# EAGLE schematic dshield (EAGLE 7.7.0)
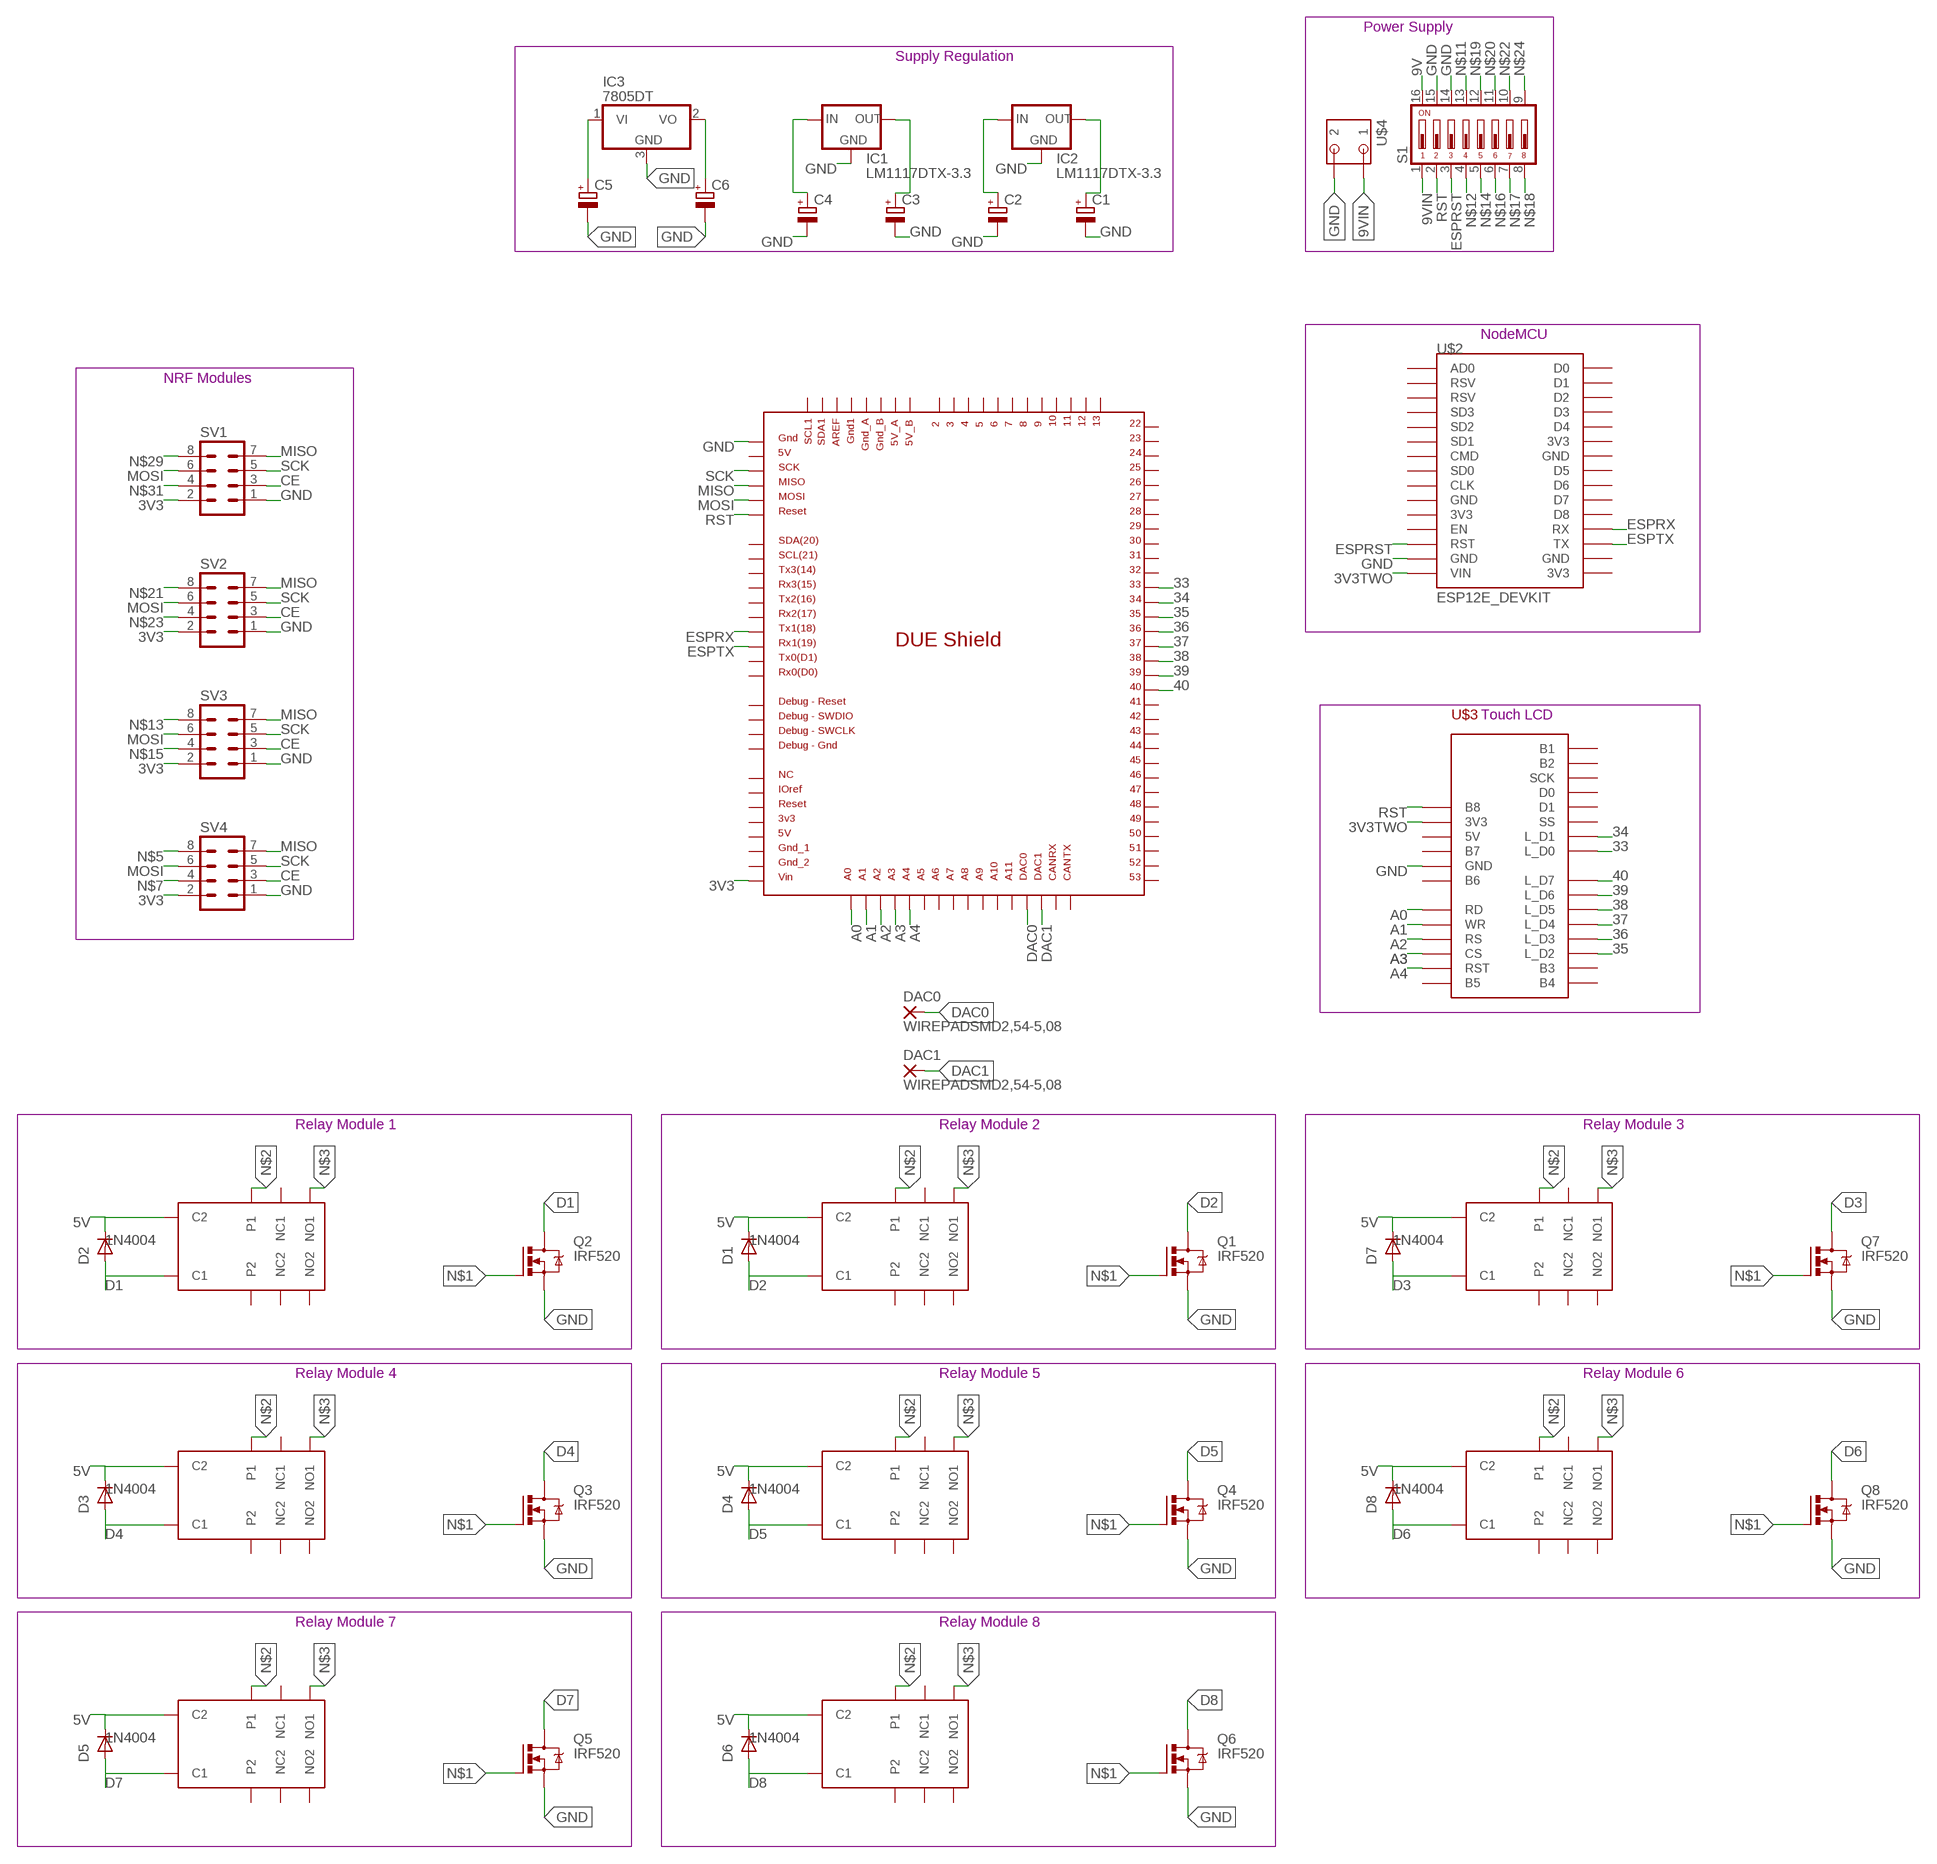
[diagram p0: schematic, sheet 1]

## Parts
BTPL1  GS-SH-2XXT  [G_RELAY_SMD]
BTPL2  GS-SH-2XXT  [G_RELAY_SMD]
BTPL3  GS-SH-2XXT  [G_RELAY_SMD]
BTPL4  GS-SH-2XXT  [G_RELAY_SMD]
BTPL5  GS-SH-2XXT  [G_RELAY_SMD]
BTPL6  GS-SH-2XXT  [G_RELAY_SMD]
BTPL7  GS-SH-2XXT  [G_RELAY_SMD]
BTPL8  GS-SH-2XXT  [G_RELAY_SMD]
C1  CPOL-EUE2.5-6  [E2,5-6]
C2  CPOL-EUE2.5-6  [E2,5-6]
C3  CPOL-EUE2.5-6  [E2,5-6]
C4  CPOL-EUE2.5-6  [E2,5-6]
C5  CPOL-EUE2.5-6  [E2,5-6]
C6  CPOL-EUE2.5-6  [E2,5-6]
D1  1N4004  [DO41-10]
D2  1N4004  [DO41-10]
D3  1N4004  [DO41-10]
D4  1N4004  [DO41-10]
D5  1N4004  [DO41-10]
D6  1N4004  [DO41-10]
D7  1N4004  [DO41-10]
D8  1N4004  [DO41-10]
DAC0  WIREPADSMD2,54-5,08  [SMD2,54-5,08]
DAC1  WIREPADSMD2,54-5,08  [SMD2,54-5,08]
IC1  LM1117DTX-3.3  [TO252]
IC2  LM1117DTX-3.3  [TO252]
IC3  7805DT  [TO252]
Q1  IRF520  [TO220BV]
Q2  IRF520  [TO220BV]
Q3  IRF520  [TO220BV]
Q4  IRF520  [TO220BV]
Q5  IRF520  [TO220BV]
Q6  IRF520  [TO220BV]
Q7  IRF520  [TO220BV]
Q8  IRF520  [TO220BV]
S1  DS08  [DS-08]
SV1  MA04-2  [MA04-2]
SV2  MA04-2  [MA04-2]
SV3  MA04-2  [MA04-2]
SV4  MA04-2  [MA04-2]
U$1  DUE(NORMAL)  [DUE(NORMAL)]
U$2  ESP12E_DEVKIT  [ESP12E_DEVKIT]
U$3  SPFD5408  [SPFD5408]
U$4  SPTBB2-A2  [SPTB]

## Nets
3V3: C3.+ IC1.TAB(OUT) SV1.2 SV2.2 SV3.2 SV4.2 U$1.VIN
3V3TWO: C1.+ IC2.TAB(OUT) U$2.VIN U$3.3V3
5V: BTPL1.C2 BTPL2.C2 BTPL3.C2 BTPL4.C2 BTPL5.C2 BTPL6.C2 BTPL7.C2 BTPL8.C2 C6.+ D1.C D2.C D3.C D4.C D5.C D6.C D7.C D8.C IC3.2(VO)
9V: C2.+ C4.+ C5.+ IC1.2(IN) IC2.2(IN) IC3.1(VI) S1.16
9VIN: S1.1 U$4.B2
33: U$1.33 U$3.L_D0
34: U$1.34 U$3.L_D1
35: U$1.35 U$3.L_D2
36: U$1.36 U$3.L_D3
37: U$1.37 U$3.L_D4
38: U$1.38 U$3.L_D5
39: U$1.39 U$3.L_D6
40: U$1.40 U$3.L_D7
A0: U$1.A0 U$3.RD
A1: U$1.A1 U$3.WR
A2: U$1.A2 U$3.RS
A3: U$1.A3 U$3.CS
A4: U$1.A4 U$3.RST
CE: SV1.3 SV2.3 SV3.3 SV4.3
D1: BTPL2.C1 D2.A Q2.D
D2: BTPL1.C1 D1.A Q1.D
D3: BTPL7.C1 D7.A Q7.D
D4: BTPL3.C1 D3.A Q3.D
D5: BTPL4.C1 D4.A Q4.D
D6: BTPL8.C1 D8.A Q8.D
D7: BTPL5.C1 D5.A Q5.D
D8: BTPL6.C1 D6.A Q6.D
DAC0: DAC0.1(P) U$1.DAC0
DAC1: DAC1.1(P) U$1.DAC1
ESPRST: S1.3 U$2.RST
ESPRX: U$1.TX1 U$2.RX
ESPTX: U$1.RX1 U$2.TX
GND: C1.- C2.- C3.- C4.- C5.- C6.- IC1.1(GND) IC2.1(GND) IC3.3(GND) Q1.S Q2.S Q3.S Q4.S Q5.S Q6.S Q7.S Q8.S S1.14 S1.15 SV1.1 SV2.1 SV3.1 SV4.1 U$1.5V_ICSP U$2.GND@1(GND) U$3.GND U$4.A2
MISO: SV1.7 SV2.7 SV3.7 SV4.7 U$1.MISO_ICSP
MOSI: SV1.6 SV2.6 SV3.6 SV4.6 U$1.MOSI_ICSP
N$1: Q1.G Q2.G Q3.G Q4.G Q5.G Q6.G Q7.G Q8.G
N$2: BTPL1.P1 BTPL2.P1 BTPL3.P1 BTPL4.P1 BTPL5.P1 BTPL6.P1 BTPL7.P1 BTPL8.P1
N$3: BTPL1.NO1 BTPL2.NO1 BTPL3.NO1 BTPL4.NO1 BTPL5.NO1 BTPL6.NO1 BTPL7.NO1 BTPL8.NO1
N$5: SV4.8
N$7: SV4.4
N$11: S1.13
N$12: S1.4
N$13: SV3.8
N$14: S1.5
N$15: SV3.4
N$16: S1.6
N$17: S1.7
N$18: S1.8
N$19: S1.12
N$20: S1.11
N$21: SV2.8
N$22: S1.10
N$23: SV2.4
N$24: S1.9
N$29: SV1.8
N$31: SV1.4
RST: S1.2 U$1.RESET_ICSP U$3.B8
SCK: SV1.5 SV2.5 SV3.5 SV4.5 U$1.SCK_ICSP
Unconnected: BTPL1.NC1 BTPL1.NC2 BTPL1.NO2 BTPL1.P2 BTPL2.NC1 BTPL2.NC2 BTPL2.NO2 BTPL2.P2 BTPL3.NC1 BTPL3.NC2 BTPL3.NO2 BTPL3.P2 BTPL4.NC1 BTPL4.NC2 BTPL4.NO2 BTPL4.P2 BTPL5.NC1 BTPL5.NC2 BTPL5.NO2 BTPL5.P2 BTPL6.NC1 BTPL6.NC2 BTPL6.NO2 BTPL6.P2 BTPL7.NC1 BTPL7.NC2 BTPL7.NO2 BTPL7.P2 BTPL8.NC1 BTPL8.NC2 BTPL8.NO2 BTPL8.P2 U$1.2 U$1.3 U$1.3V3 U$1.4 U$1.5 U$1.5V U$1.5V_A U$1.5V_B U$1.6 U$1.7 U$1.8 U$1.9 U$1.10 U$1.11 U$1.12 U$1.13 U$1.22 U$1.23 U$1.24 U$1.25 U$1.26 U$1.27 U$1.28 U$1.29 U$1.30 U$1.31 U$1.32 U$1.41 U$1.42 U$1.43 U$1.44 U$1.45 U$1.46 U$1.47 U$1.48 U$1.49 U$1.50 U$1.51 U$1.52 U$1.53 U$1.A5 U$1.A6 U$1.A7 U$1.A8 U$1.A9 U$1.A10 U$1.A11 U$1.AREF U$1.CANRX U$1.CANTX U$1.GND1 U$1.GND_1 U$1.GND_2 U$1.GND_A U$1.GND_B U$1.GND_DEBUG U$1.GND_ICSP U$1.IOREF U$1.NC U$1.RESET U$1.RESET_DEBUG U$1.RX0 U$1.RX2 U$1.RX3 U$1.SCL U$1.SCL1 U$1.SDA U$1.SDA1 U$1.SWCLK_DEBUG U$1.SWDIO_DEBUG U$1.TX0 U$1.TX2 U$1.TX3 U$2.3V3@0(3V3) U$2.3V3@1(3V3) U$2.3V3@2(3V3) U$2.AD0 U$2.CLK U$2.CMD U$2.D0 U$2.D1 U$2.D2 U$2.D3 U$2.D4 U$2.D5 U$2.D6 U$2.D7 U$2.D8 U$2.EN U$2.GND@0(GND) U$2.GND@2(GND) U$2.GND@3(GND) U$2.RSV@0(RSV) U$2.RSV@1(RSV) U$2.SD0 U$2.SD1 U$2.SD2 U$2.SD3 U$3.5V U$3.B1 U$3.B2 U$3.B3 U$3.B4 U$3.B5 U$3.B6 U$3.B7 U$3.D0 U$3.D1 U$3.SCK U$3.SS

## Notes on the sheet
- Power Supply
- Supply Regulation
- NodeMCU
- NRF Modules
- Touch LCD
- Relay Module 1 | Relay Module 2 | Relay Module 3
- Relay Module 4 | Relay Module 5 | Relay Module 6
- Relay Module 7 | Relay Module 8

## Library data of the parts
BTPL1-BTPL8 = goodsky_btpl:GS-SH-2XXT: goodsky plastic shielded relay
C1-C6 = rcl:CPOL-EU: POLARIZED CAPACITOR, European symbol
D1-D8 = diode:1N4004: DIODE general purpose rectifier, 1 A
DAC0 DAC1 = wirepad:WIREPAD: Wire PAD connect wire on PCB
IC1 IC2 = lm1117:LM1117DTX-*
IC3 = linear:78*: Positive VOLTAGE REGULATOR Source: http://cache.national.com/ds/LM/LM78L05.pdf http://www.fairchildsemi.com/ds/LM/LM7805.pdf
Q1-Q8 = transistor-power:IRF520: HEXFET Power MOSFET
S1 = switch-dil:DS08: DIL/CODE SWITCH; MPN: DS08; OC_FARNELL: unknown; OC_NEWARK: 73J0071
SV1-SV4 = con-lstb:MA04-2: PIN HEADER; OC_FARNELL: unknown; OC_NEWARK: unknown
U$1 = DUElib130425:DUE(NORMAL)
U$2 = ESP12E_DEVKIT:ESP12E_DEVKIT: ESP12E DEVKIT BOARD
U$3 = SPFD5408:SPFD5408
U$4 = #rcn-15:SPTB